# EAGLE design revA (EAGLE 7.4.0)
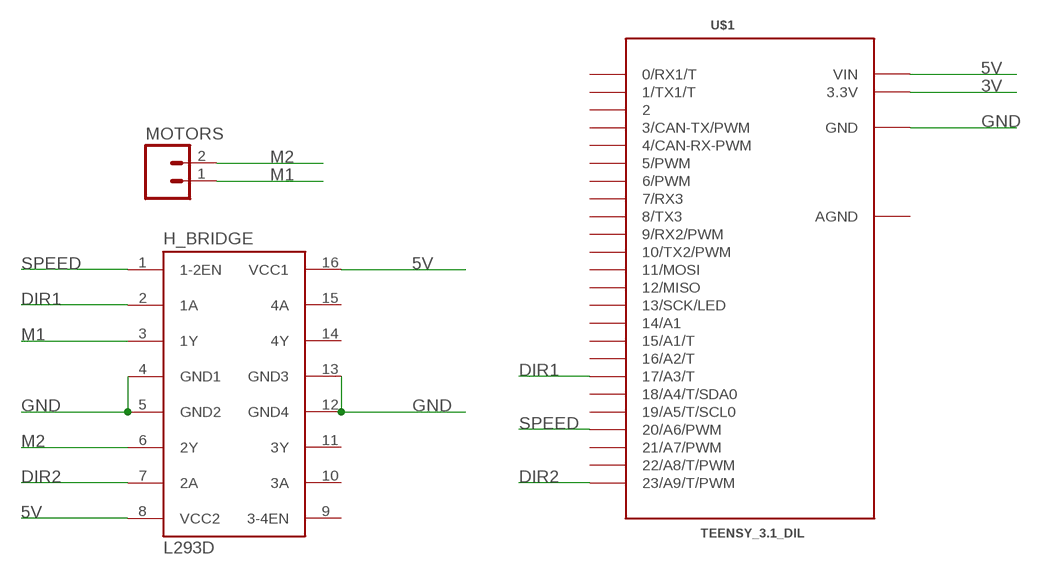
[diagram p0: schematic, sheet 1]

## Parts
H_BRIDGE  L293D  [DIL16]
MOTORS  M02JST-PTH-2  [JST-2-PTH]
U$1  TEENSY_3.1_DIL  [TEENSY3-DIL]

## Nets
3V: U$1.3.3V
5V: H_BRIDGE.8(VCC2) H_BRIDGE.16(VCC1) U$1.VIN
DIR1: H_BRIDGE.2(1A) U$1.17/A3(17/A3/T)
DIR2: H_BRIDGE.7(2A) U$1.23/A9(23/A9/T/PWM)
GND: H_BRIDGE.4(GND1) H_BRIDGE.5(GND2) H_BRIDGE.12(GND4) H_BRIDGE.13(GND3) U$1.GND
M1: H_BRIDGE.3(1Y) MOTORS.1
M2: H_BRIDGE.6(2Y) MOTORS.2
SPEED: H_BRIDGE.1(1-2EN) U$1.20/A6(20/A6/PWM)
Unconnected: H_BRIDGE.9(3-4EN) H_BRIDGE.10(3A) H_BRIDGE.11(3Y) H_BRIDGE.14(4Y) H_BRIDGE.15(4A) U$1.0(0/RX1/T) U$1.1(1/TX1/T) U$1.2 U$1.3(3/CAN-TX/PWM) U$1.4(4/CAN-RX-PWM) U$1.5(5/PWM) U$1.6(6/PWM) U$1.7(7/RX3) U$1.8(8/TX3) U$1.9(9/RX2/PWM) U$1.10(10/TX2/PWM) U$1.11(11/MOSI) U$1.12(12/MISO) U$1.13(13/SCK/LED) U$1.14/A0(14/A1) U$1.15/A1(15/A1/T) U$1.16/A2(16/A2/T) U$1.18/A4(18/A4/T/SDA0) U$1.19/A5(19/A5/T/SCL0) U$1.21/A7(21/A7/PWM) U$1.22/A8(22/A8/T/PWM)

## Power pins joined to a net without a drawn wire
AGND: U$1.AGND

## Library data of the parts
H_BRIDGE = st-microelectronics:L293D: PUSH-PULL 4 CHANNEL DRIVER; MPN: L293D; OC_FARNELL: 9589619; OC_NEWARK: 56P8249
MOTORS = SparkFun-Connectors:M02: Standard 2-pin 0.1" header. Use with - straight break away headers ( PRT-00116) - right angle break away headers (PRT-00553) - swiss pins (PRT-00743) - machine pins (PRT-00117) - female headers (PRT-00115) Molex polarized connector foot print use with: PRT-08233 with associated crimp pins and housings. 2.54_SCREWTERM for use with PRT-10571. 3.5mm Screw Terminal footprints for PRT-08084 5mm Screw Terminal footprints for use with PRT-08432; PROD_ID: CONN-09863; SKU: PRT-09914
U$1 = Teensy_3_and_LC_Series_Boards_v1.1:TEENSY_3.1_DIL: Teensy 3.1 or 3.2 in a DIL Layout.

## Board
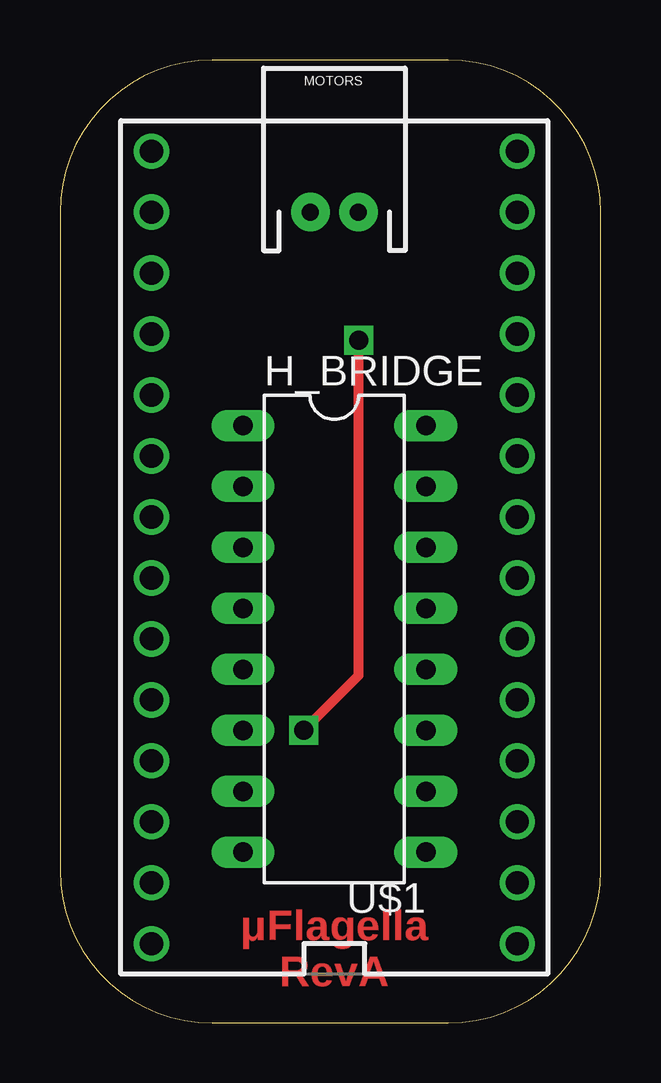
[diagram p1: board, top side]
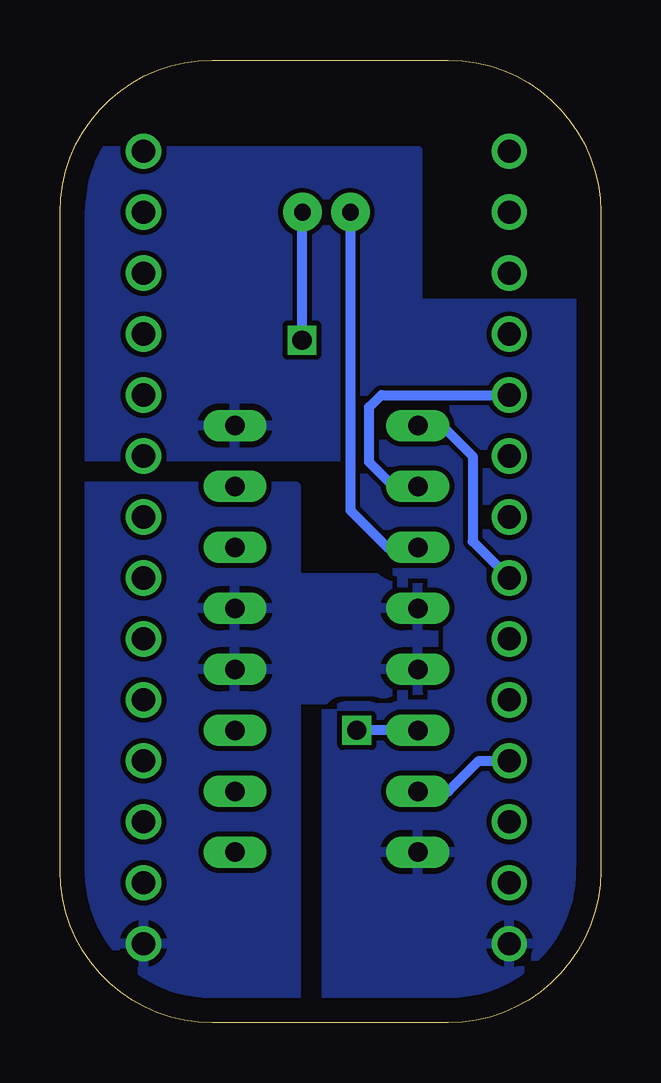
[diagram p2: board, bottom side, seen from below]

Size 22.53 x 40.12 mm. Coordinates in mm from the lower left corner, seen from the top.
Outline: 16.18,40.12 6.35,40.12 arc90 0,33.77 0,6.35 arc90 6.35,0 16.18,0 arc90 22.53,6.35 22.53,33.77 arc90 16.18,40.12
Copper layers (1*16): Top 0.035mm / dielectric 1.5mm / Bottom 0.035mm
Design rules "default": minimum track width 10mil, minimum drill 24mil, track to track 8mil, track to pad 8mil, pad to pad 8mil, via to via 8mil, smd to smd 8mil, copper to edge 40mil, drill to drill 8mil, minimum pad ring 10mil, minimum via ring 8mil, stop-mask expansion 4mil, vias tented up to drill 0mil, thermal gap 10mil

### Footprints (pad centres in the part's own frame; a part is rotated, then mirrored left to right if it is on the bottom)
DIL16 = drill 0.813 long: 1 -8.89,-3.81; 2 -6.35,-3.81; 3 -3.81,-3.81; 4 -1.27,-3.81; 5 1.27,-3.81; 6 3.81,-3.81; 7 6.35,-3.81; 8 8.89,-3.81; 9 8.89,3.81; 10 6.35,3.81; 11 3.81,3.81; 12 1.27,3.81; 13 -1.27,3.81; 14 -3.81,3.81; 15 -6.35,3.81; 16 -8.89,3.81
JST-2-PTH = drill 0.7 pad 1.6: 1 -1,0; 2 1,0
TEENSY3-DIL = drill 0.965: 0 -7.62,13.97; 1 -7.62,11.43; 2 -7.62,8.89; 3 -7.62,6.35; 3.3V 7.62,11.43; 4 -7.62,3.81; 5 -7.62,1.27; 6 -7.62,-1.27; 7 -7.62,-3.81; 8 -7.62,-6.35; 9 -7.62,-8.89; 10 -7.62,-11.43; 11 -7.62,-13.97; 12 -7.62,-16.51; 13 7.62,-16.51; 14/A0 7.62,-13.97; 15/A1 7.62,-11.43; 16/A2 7.62,-8.89; 17/A3 7.62,-6.35; 18/A4 7.62,-3.81; 19/A5 7.62,-1.27; 20/A6 7.62,1.27; 21/A7 7.62,3.81; 22/A8 7.62,6.35; 23/A9 7.62,8.89; AGND 7.62,13.97; GND -7.62,16.51; VIN 7.62,16.51

### Placement (x,y rotation side)
H_BRIDGE  11.43,16 270 top
MOTORS  11.43,33.78 0 top
U$1  11.43,19.81 180 top

### Tracks (layer width: path | path; a pad name or v marks a point on that pad's centre or on a via)
5V
  pour Bottom (rank 2): -2.54,29.97 11.43,29.97 11.43,-5.59 -2.54,-5.59
  pour Bottom: 7.62,36.32 21.59,36.32 21.59,23.62 7.62,23.62
DIR1
  Bottom 0.406: H_BRIDGE.2 8.64,22.35 9.65,23.37 9.65,25.65 9.14,26.16 U$1.17/A3
DIR2
  Bottom 0.406: H_BRIDGE.7 6.35,9.65 5.08,10.92 U$1.23/A9
GND
  pour Bottom: 12.7,22.35 12.7,-1.78 24.13,-1.78 24.13,22.35
  pour Bottom (isolate 0.813): 17.78,18.54 6.99,18.54 6.99,13.46 17.78,13.46
M1
  Bottom 0.406: H_BRIDGE.3 8.89,19.81 10.43,21.35 MOTORS.1
M2  (via drill 0.8)
  Top 0.406: v10.16,12.19 12.45,14.48 v12.45,28.45
  Bottom 0.406: H_BRIDGE.6 v10.16,12.19 | v12.45,28.45 12.45,33.77 MOTORS.2
SPEED
  Bottom 0.406: H_BRIDGE.1 6.6,24.89 5.33,23.62 5.33,20.07 U$1.20/A6

### Text on the board
Top: μFlagella / RevA